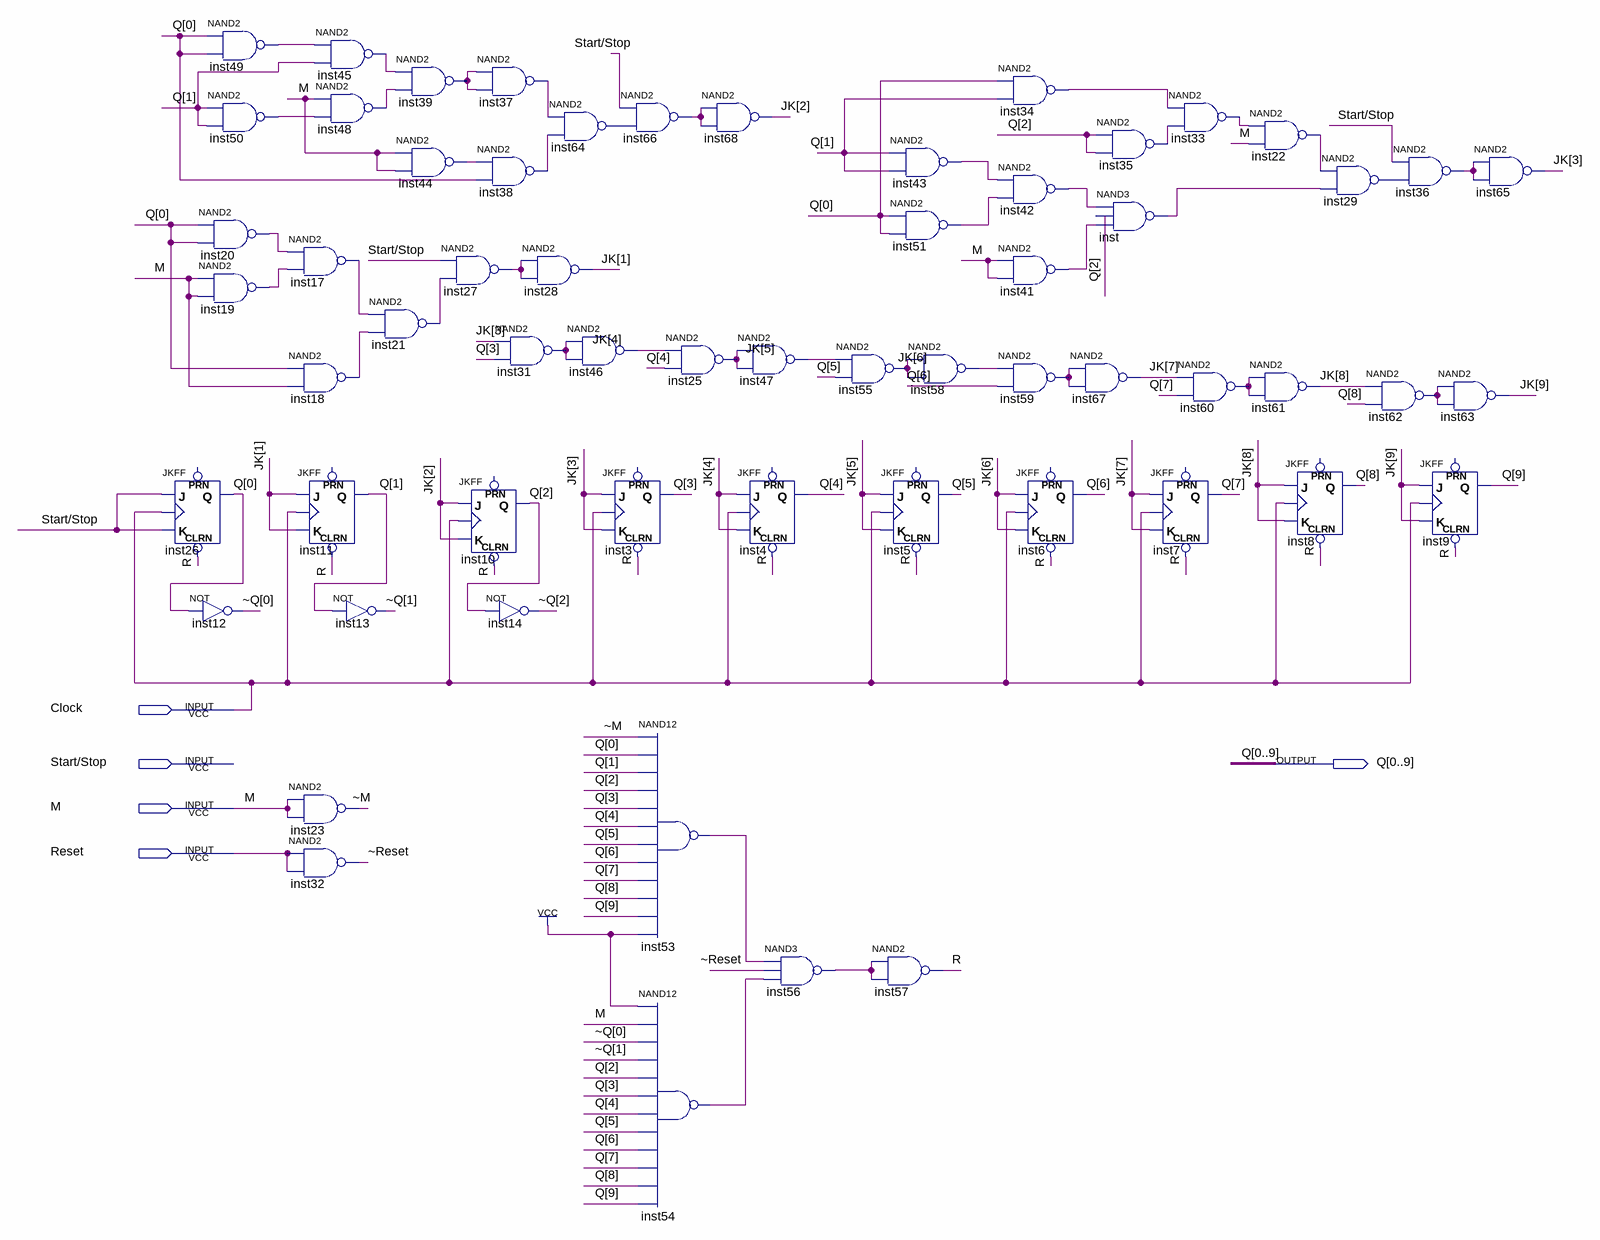
[diagram p0: schematic sheet]
// Quartus schematic 1.bdf as structural Verilog: 61 symbols, 5 pins
module \1  (
  input  Clock,
  input  \Start/Stop ,
  input  M,
  input  Reset,
  output [0:9] Q
);

  wire inst17_out, inst18_out, inst19_out, inst20_out, inst21_out, inst22_out, inst25_out, inst27_out,
       inst29_out, inst31_out, inst33_out, inst34_out, inst35_out, inst36_out, inst37_out, inst38_out,
       inst39_out, inst41_out, inst42_out, inst43_out, inst44_out, inst45_out, inst48_out, inst49_out,
       inst50_out, inst51_out, inst53_out, inst54_out, inst55_out, inst56_out, inst59_out, inst60_out,
       inst62_out, inst64_out, inst66_out, inst_out, R, \~M , \~Reset ;
  wire [2:0] \~Q ;
  wire [9:1] JK;

  JKFF inst26 (.CLRN(R), .K(\Start/Stop ), .J(\Start/Stop ), .CLK(Clock), .Q(Q[0]));  // open: PRN
  not inst12 (\~Q [0], Q[0]);
  nand inst49 (inst49_out, Q[0], Q[0]);
  nand inst50 (inst50_out, Q[1], Q[1]);
  nand inst20 (inst20_out, Q[0], Q[0]);
  nand inst19 (inst19_out, M, M);
  nand inst45 (inst45_out, inst49_out, Q[1]);
  nand inst48 (inst48_out, M, inst50_out);
  nand inst17 (inst17_out, inst20_out, inst19_out);
  nand inst18 (inst18_out, Q[0], M);
  JKFF inst11 (.CLRN(R), .K(JK[1]), .J(JK[1]), .CLK(Clock), .Q(Q[1]));  // open: PRN
  not inst13 (\~Q [1], Q[1]);
  nand inst23 (\~M , M, M);
  nand inst32 (\~Reset , Reset, Reset);
  nand inst39 (inst39_out, inst45_out, inst48_out);
  nand inst44 (inst44_out, M, M);
  nand inst21 (inst21_out, inst17_out, inst18_out);
  nand inst37 (inst37_out, inst39_out, inst39_out);
  nand inst38 (inst38_out, inst44_out, Q[0]);
  nand inst27 (inst27_out, \Start/Stop , inst21_out);
  JKFF inst10 (.CLRN(R), .K(JK[2]), .J(JK[2]), .CLK(Clock), .Q(Q[2]));  // open: PRN
  nand inst64 (inst64_out, inst37_out, inst38_out);
  nand inst28 (JK[1], inst27_out, inst27_out);
  nand inst31 (inst31_out, JK[3], Q[3]);
  not inst14 (\~Q [2], Q[2]);
  nand inst66 (inst66_out, \Start/Stop , inst64_out);
  nand inst46 (JK[4], inst31_out, inst31_out);
  JKFF inst3 (.CLRN(R), .K(JK[3]), .J(JK[3]), .CLK(Clock), .Q(Q[3]));  // open: PRN
  nand inst25 (inst25_out, JK[4], Q[4]);
  nand inst53 (inst53_out, \~M , Q[0], Q[1], Q[2], Q[3], Q[4], Q[5], Q[6], Q[7], Q[8], Q[9], 1'b1);
  nand inst54 (inst54_out, 1'b1, M, \~Q [0], \~Q [1], Q[2], Q[3], Q[4], Q[5], Q[6], Q[7], Q[8], Q[9]);
  nand inst68 (JK[2], inst66_out, inst66_out);
  nand inst47 (JK[5], inst25_out, inst25_out);
  JKFF inst4 (.CLRN(R), .K(JK[4]), .J(JK[4]), .CLK(Clock), .Q(Q[4]));  // open: PRN
  nand inst56 (inst56_out, inst53_out, \~Reset , inst54_out);
  nand inst55 (inst55_out, JK[5], Q[5]);
  nand inst43 (inst43_out, Q[1], Q[1]);
  nand inst51 (inst51_out, Q[0], Q[0]);
  nand inst58 (JK[6], inst55_out, inst55_out);
  JKFF inst5 (.CLRN(R), .K(JK[5]), .J(JK[5]), .CLK(Clock), .Q(Q[5]));  // open: PRN
  nand inst57 (R, inst56_out, inst56_out);
  nand inst34 (inst34_out, Q[0], Q[1]);
  nand inst42 (inst42_out, inst43_out, inst51_out);
  nand inst41 (inst41_out, M, M);
  nand inst59 (inst59_out, JK[6], Q[6]);
  JKFF inst6 (.CLRN(R), .K(JK[6]), .J(JK[6]), .CLK(Clock), .Q(Q[6]));  // open: PRN
  nand inst35 (inst35_out, Q[2], Q[2]);
  nand inst (inst_out, inst42_out, Q[2], inst41_out);
  nand inst67 (JK[7], inst59_out, inst59_out);
  nand inst33 (inst33_out, inst34_out, inst35_out);
  nand inst60 (inst60_out, JK[7], Q[7]);
  JKFF inst7 (.CLRN(R), .K(JK[7]), .J(JK[7]), .CLK(Clock), .Q(Q[7]));  // open: PRN
  nand inst22 (inst22_out, inst33_out, M);
  nand inst61 (JK[8], inst60_out, inst60_out);
  nand inst29 (inst29_out, inst22_out, inst_out);
  JKFF inst8 (.CLRN(R), .K(JK[8]), .J(JK[8]), .CLK(Clock), .Q(Q[8]));  // open: PRN
  nand inst36 (inst36_out, \Start/Stop , inst29_out);
  nand inst62 (inst62_out, JK[8], Q[8]);
  nand inst65 (JK[3], inst36_out, inst36_out);
  nand inst63 (JK[9], inst62_out, inst62_out);
  JKFF inst9 (.CLRN(R), .K(JK[9]), .J(JK[9]), .CLK(Clock), .Q(Q[9]));  // open: PRN
endmodule
